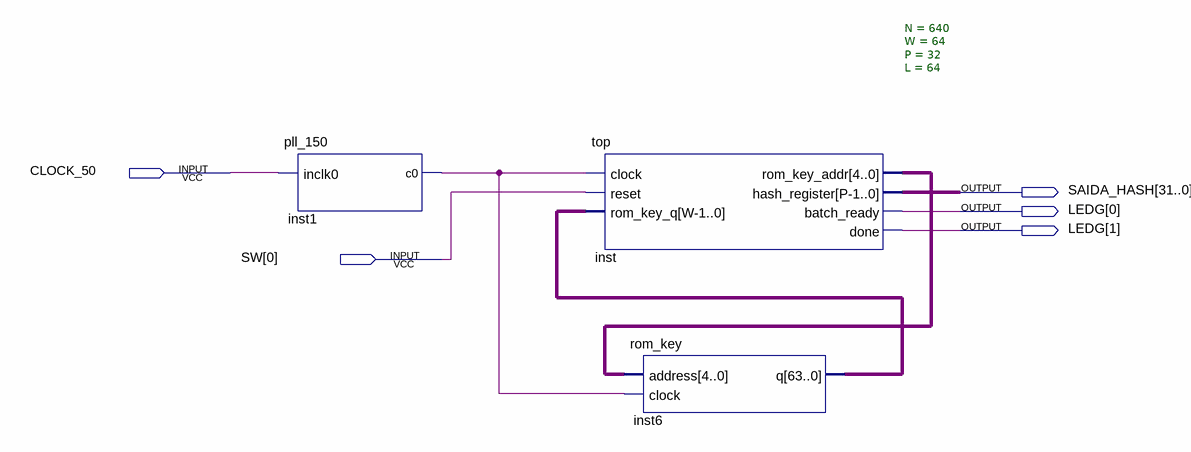
[diagram p0: schematic sheet]
// Quartus schematic sistema_completo.bdf as structural Verilog: 3 symbols, 5 pins
module sistema_completo (
  input  CLOCK_50,
  input  [0:0] SW,
  output [31:0] SAIDA_HASH,
  output [1:0] LEDG
);

  wire inst1_c0;
  wire [4:0] inst_rom_key_addr;
  wire [63:0] inst6_q;

  pll_150 inst1 (.inclk0(CLOCK_50), .c0(inst1_c0));
  top #(.N(640), .W(64), .P(32), .L(64)) inst (
    .clock(inst1_c0), .reset(SW[0]), .rom_key_q(inst6_q), .rom_key_addr(inst_rom_key_addr),
    .hash_register(SAIDA_HASH), .batch_ready(LEDG[0]), .done(LEDG[1]));
  rom_key inst6 (.address(inst_rom_key_addr), .clock(inst1_c0), .q(inst6_q));
endmodule
